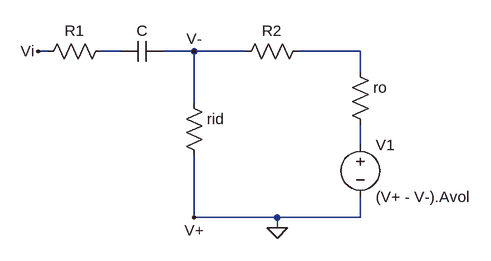
[diagram p0: schematic Draft1.asc]
Draft1.asc, the LTspice schematic file:
Version 4
SHEET 1 880 680
WIRE -64 96 -80 96
WIRE 48 96 16 96
WIRE 160 96 112 96
WIRE 240 96 160 96
WIRE 416 96 320 96
WIRE 416 128 416 96
WIRE 160 176 160 96
WIRE 416 240 416 208
WIRE 160 352 160 256
WIRE 288 352 160 352
WIRE 416 352 416 320
WIRE 416 352 288 352
WIRE 288 368 288 352
FLAG 288 368 0
FLAG -80 96 Vi
FLAG 160 96 V-
FLAG 160 352 V+
SYMBOL res 32 80 R90
WINDOW 0 0 56 VBottom 2
WINDOW 3 32 56 VTop 2
SYMATTR InstName R1
SYMATTR Value ""
SYMBOL cap 112 80 R90
WINDOW 0 0 32 VBottom 2
WINDOW 3 32 32 VTop 2
SYMATTR InstName C
SYMATTR Value ""
SYMBOL res 144 160 R0
SYMATTR InstName rid
SYMATTR Value ""
SYMBOL res 336 80 R90
WINDOW 0 0 56 VBottom 2
WINDOW 3 32 56 VTop 2
SYMATTR InstName R2
SYMATTR Value ""
SYMBOL res 400 112 R0
SYMATTR InstName ro
SYMATTR Value ""
SYMBOL voltage 416 224 R0
SYMATTR InstName V1
SYMATTR Value (V+ - V-).Avol

The netlist it stands for:
* Draft1.asc
R1 N001 Vi
C V- N001
rid V- 0
R2 N002 V-
ro N002 N003
V1 N003 0 (V+ - V-).Avol
.backanno
.end